# EAGLE design Strvo_Tester_STM_v4 (EAGLE 6.5.0)
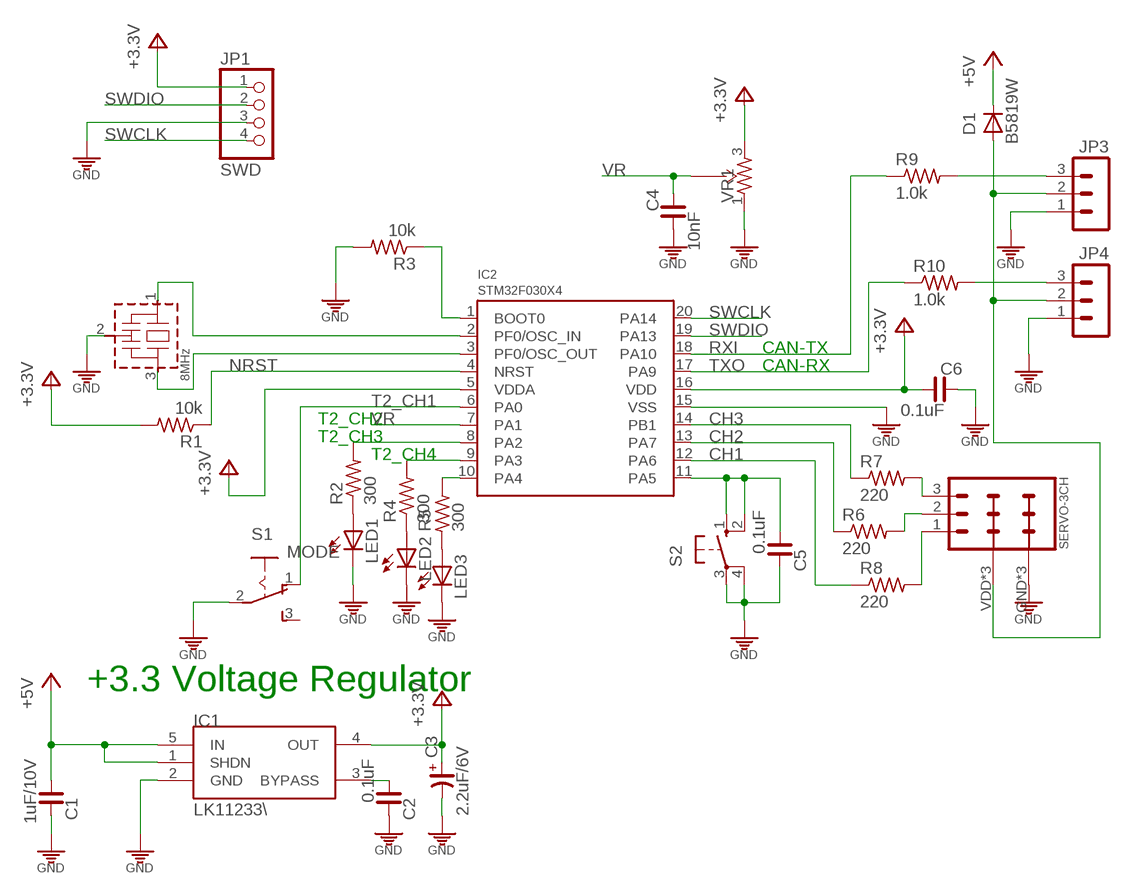
[diagram p0: schematic, sheet 1]

## Parts
C1  1uF/10V  C_0603  [C0603]
C2  0.1uF  C_0603  [C0603]
C3  2.2uF/6V  CP_2012  [C2012/T]
C4  10nF  C_0603  [C0603]
C5  0.1uF  C_0603  [C0603]
C6  0.1uF  C_0603  [C0603]
D1  B5819W  B5189WN  [SOD323]
IC1  LK11233\  LK112XX  [SOT23-5L]
IC2  STM32F030X4  [TSSOP20]
JP1  SWD  PINHD-1X4M  [1X04M]
JP2  SERVO-3CH  [SERVO-3CH1]
JP3  MA03-1SMALL  [MA03-1-S]
JP4  MA03-1SMALL  [MA03-1-S]
LED1  LED3MM  [LED3MM]
LED2  LED3MM  [LED3MM]
LED3  LED3MM  [LED3MM]
Q1  8MHz  X-TAL-SMALLCSTCE16M00V53  [CSTLA_X]
R1  10k  R-US_R1608  [R0603]
R2  300  R-US_R1608  [R0603]
R3  10k  R-US_R1608  [R0603]
R4  300  R-US_R1608  [R0603]
R5  300  R_0603  [R0603]
R6  220  R-US_R1608  [R0603]
R7  220  R-US_R1608  [R0603]
R8  220  R-US_R1608  [R0603]
R9  1.0k  R-US_R1608  [R0603]
R10  1.0k  R-US_R1608  [R0603]
S1  MODE  IMMS  [255SB]
S2  10-XX  [B3F-10XX]
VR1  R-TRIMMER-SMDPTV  [PTV09]

## Nets
3V3: C3.+ C6.2 IC1.4(OUT) IC2.5(VDDA) IC2.16(VDD) JP1.1 R1.2 VR1.3 ; supply symbol labelled +3V3
+5V: C1.2 D1.C IC1.1(SHDN) IC1.5(IN)
CH1: IC2.12(PA6) R8.1
CH2: IC2.13(PA7) R6.1
CH3: IC2.14(PB1) R7.1
GND: C1.1 C2.1 C3.- C4.2 C5.1 C6.1 IC1.2(GND) IC2.15(VSS) JP1.3 JP2.GND JP2.GND@1(GND) JP2.GND@2(GND) JP3.1 JP4.1 LED1.K(C) LED2.K(C) LED3.K(C) Q1.2(GND) R3.2 S1.2(P) S2.3(P) S2.4(P1) VR1.1
N$1: LED1.A R2.1
N$2: IC2.2(PF0/OSC_IN) Q1.1(IN)
N$3: IC2.3(PF0/OSC_OUT) Q1.3(OUT)
N$4: JP2.3 R7.2
N$5: IC2.8(PA2) R2.2
N$6: IC2.1(BOOT0) R3.1
N$7: C5.2 IC2.11(PA5) S2.1(S) S2.2(S1)
N$8: C2.2 IC1.3(BYPASS)
N$9: JP2.2 R6.2
N$10: IC2.10(PA4) R5.2
N$11: LED2.A R4.1
N$12: JP2.1 R8.2
N$13: IC2.9(PA3) R4.2
N$14: JP3.3 R9.2
N$15: JP4.3 R10.2
N$17: LED3.A R5.1
N$18: D1.A JP2.VDD(+5V) JP2.VDD@1(+5V) JP2.VDD@2(+5V) JP3.2 JP4.2
NRST: IC2.4(NRST) R1.1
RXI: IC2.18(PA10) R9.1
SWCLK: IC2.20(PA14) JP1.4
SWDIO: IC2.19(PA13) JP1.2
T2_CH1: IC2.6(PA0) S1.1(O)
TXO: IC2.17(PA9) R10.1
VR: C4.1 IC2.7(PA1) VR1.2
Unconnected: S1.3(S)

## Notes on the sheet
- CAN-TX
- CAN-RX
- T2_CH2
- T2_CH3
- T2_CH4
- +3.3 Voltage Regulator

## Library data of the parts
C1 C2 C4-C6 = cona_lib:C_: NON-POLARIZED CAP
C3 = rc-master-smd:CP_: POLARIZED CAP
D1 = cona_lib:B5189W
IC1 = cona_lib:LK112XX: ST
IC2 = stm32:STM32F030X4
JP1 = pinhead:PINHD-1X4: PIN HEADER
JP2 = cona_lib:SERVO-3CH
JP3 JP4 = cona_lib:MA03-1: PIN HEADER
LED1-LED3 = cona_lib:LED: LED OSRAM: - CHIPLED LG R971, LG N971, LY N971, LG Q971, LY Q971, LO R971, LY R971 LH N974, LH R974 LS Q976, LO Q976, LY Q976 LO Q996 - Hyper CHIPLED LW Q18S LB Q993, LB Q99A, LB R99A - SideLED LS A670, LO A670, LY A670, LG A670, LP A670 LB A673, LV A673, LT A673, LW A673 LH A674 LY A675 LS A676, LA A676, LO A676, LY A676, LW A676 LS A679, LY A679, LG A679 - Hyper Micro SIDELED® LS Y876, LA Y876, LO Y876, LY Y876 LT Y87S - SmartLED LW L88C, LW L88S LB L89C, LB L89S, LG L890 LS L89K, LO L89K, LY L89K LS L896, LA L896, LO L896, LY L896 - TOPLED LS T670, LO T670, LY T670, LG T670, LP T670 LSG T670, LSP T670, LSY T670, LOP T670, LYG T670 LG T671, LOG T671, LSG T671 LB T673, LV T673, LT T673, LW T673 LH T674 LS T676, LA T676, LO T676, LY T676, LB T676, LH T676, LSB T676, LW T676 LB T67C, LV T67C, LT T67C, LS T67K, LO T67K, LY T67K, LW E67C LS E67B, LA E67B, LO E67B, LY E67B, LB E67C, LV E67C, LT E67C LW T67C LS T679, LY T679, LG T679 LS T770, LO T770, LY T770, LG T770, LP T770 LB T773, LV T773, LT T773, LW T773 LH T774 LS E675, LA E675, LY E675, LS T675 LS T776, LA T776, LO T776, LY T776, LB T776 LHGB T686 LT T68C, LB T68C - Hyper Mini TOPLED® LB M676 - Mini TOPLED Santana® LG M470 LS M47K, LO M47K, LY M47K Source: http://www.osram.convergy.de LUXEON: - LUMILED® LXK2-PW12-R00, LXK2-PW12-S00, LXK2-PW14-U00, LXK2-PW14-V00 LXK2-PM12-R00, LXK2-PM12-S00, LXK2-PM14-U00 LXK2-PE12-Q00, LXK2-PE12-R00, LXK2-PE12-S00, LXK2-PE14-T00, LXK2-PE14-U00 LXK2-PB12-K00, LXK2-PB12-L00, LXK2-PB12-M00, LXK2-PB14-N00, LXK2-PB14-P00, LXK2-PB14-Q00 LXK2-PR12-L00, LXK2-PR12-M00, LXK2-PR14-Q00, LXK2-PR14-R00 LXK2-PD12-Q00, LXK2-PD12-R00, LXK2-PD12-S00 LXK2-PH12-R00, LXK2-PH12-S00 LXK2-PL12-P00, LXK2-PL12-Q00, LXK2-PL12-R00 Source: www.luxeon.com KINGBRIGHT: KA-3528ASYC Source: www.kingbright.com
Q1 = cona_lib:X-TAL-SMALL: Ceramic Resonators MuRata CSTCE08MOOG52A
R1-R4 R6-R10 = cona_lib:R-US_: RESISTOR, American symbol
R5 = cona_lib:R_: RESISTOR
S1 = cona_lib:IMMS: SLIDING SWITCH Distributor Buerklin, 11G810
S2 = switch-omron:10-XX: OMRON SWITCH; MPN: B3F-1000; OC_FARNELL: 176432; OC_NEWARK: 36M3542
VR1 = cona_lib:R-TRIMMER-SMD: SMD R-TRIMMER

## Net classes
0 default: width 0.178 mm, drill 0.3 mm, clearance 0.178 mm
2 GND: width 0.406 mm, clearance 0.152 mm

## Board
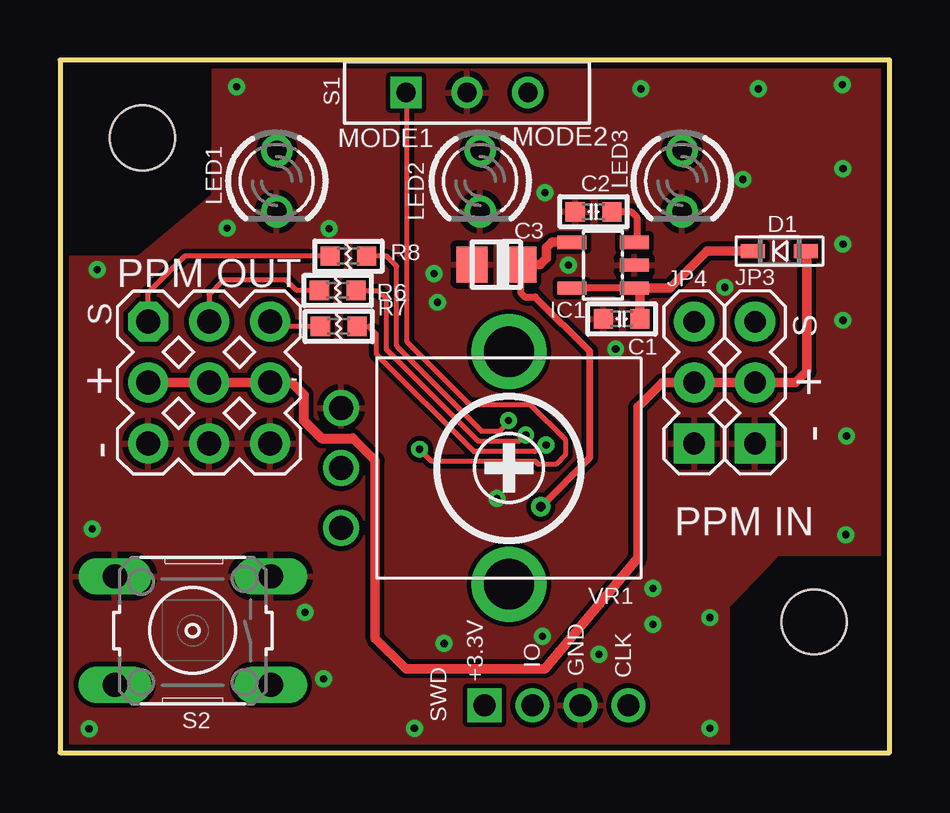
[diagram p1: board, top side]
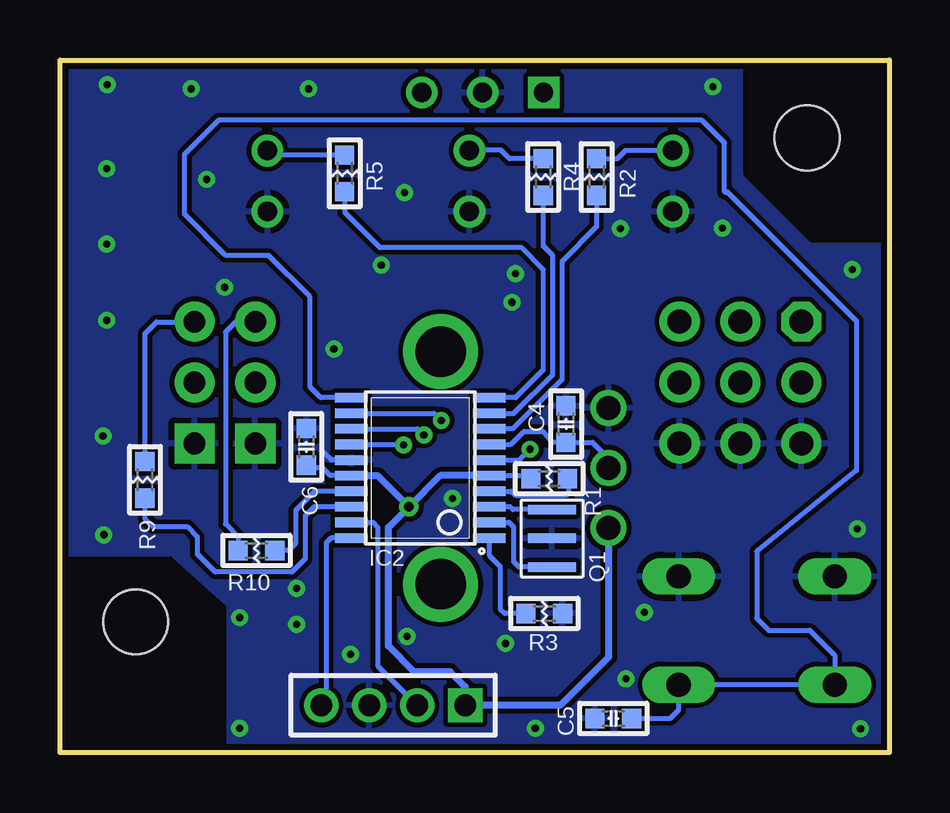
[diagram p2: board, bottom side, seen from below]

Size 34.58 x 28.88 mm. Coordinates in mm from the lower left corner, seen from the top.
Outline: 34.58,0 34.58,28.88 0,28.88 0,0 34.58,0
Copper layers (1+16): Top 0.035mm / dielectric 1.5mm / Bottom 0.035mm
Design rules "default": minimum track width 0.2mm, minimum drill 0.3mm, track to track 0.2mm, track to pad 0.2mm, pad to pad 0.2mm, via to via 0.2mm, smd to smd 0.2mm, copper to edge 10mil, drill to drill 0.2mm, minimum pad ring 10mil, minimum via ring 8mil, stop-mask expansion 4mil, vias tented up to drill 0mil, thermal gap 10mil
Holes 2.7 mm at 31.43,5.45 3.43,25.63

### Footprints (pad centres in the part's own frame; a part is rotated, then mirrored left to right if it is on the bottom)
C0603 = smd 0.8 x 0.8: 1 -0.762,0; 2 0.762,0
C2012/T = smd 1.3 x 1.5: + 1.016,0; - -1.016,0
SOD323 = smd 1 x 0.6: A 1.1,0; C -1.1,0
SOT23-5L = smd 0.55 x 1.2: 1 -0.95,-1.3; 2 0,-1.3; 3 0.95,-1.3; 4 0.95,1.3; 5 -0.95,1.3
TSSOP20 = smd 0.4 x 1.35: 1 -2.925,-2.875; 2 -2.275,-2.875; 3 -1.625,-2.875; 4 -0.975,-2.875; 5 -0.325,-2.875; 6 0.325,-2.875; 7 0.975,-2.875; 8 1.625,-2.875; 9 2.275,-2.875; 10 2.925,-2.875; 11 2.925,2.875; 12 2.275,2.875; 13 1.625,2.875; 14 0.975,2.875; 15 0.325,2.875; 16 -0.325,2.875; 17 -0.975,2.875; 18 -1.625,2.875; 19 -2.275,2.875; 20 -2.925,2.875
1X04M = drill 0.914 square: 1 -3,0 | drill 0.914: 2 -1,0; 3 1,0; 4 3,0
SERVO-3CH1 = drill 1 pad 1.676 octagon: 1 -2.54,2.54 | drill 1 pad 1.676: 2 0,2.54; 3 2.54,2.54; GND -2.54,-2.54; GND@1 0,-2.54; GND@2 2.54,-2.54; VDD -2.54,0; VDD@1 0,0; VDD@2 2.54,0
MA03-1-S = drill 0.9 pad 1.676 square: 1 -2.54,0 | drill 0.9 pad 1.676: 2 0,0; 3 2.54,0
LED3MM = drill 0.813: A -1.27,0; K 1.27,0
CSTLA_X = smd 0.4 x 2: 1 -1.19,-0.02; 2 0.01,-0.02; 3 1.21,-0.02
R0603 = smd 0.8 x 0.8: 1 -0.762,0; 2 0.762,0
255SB = drill 0.8 square: 1 -2.54,0 | drill 0.8: 2 0,0; 3 2.54,0
B3F-10XX = drill 1.016 long: 1 -3.251,2.261; 2 3.251,2.261; 3 -3.251,-2.261; 4 3.251,-2.261
PTV09 = drill 1: 1 -2.5,-7; 2 0,-7; 3 2.5,-7 | drill 2.1 pad 2.54: P$1 -4.85,0; P$2 4.85,0

### Placement (x,y rotation side)
C1  23.41,18.09 0 top
C2  22.23,22.55 0 top
C3  18.18,20.35 0 top
C4  13.49,13.7 90 bottom
C5  11.51,1.43 0 bottom
C6  24.31,12.75 270 bottom
D1  29.98,20.91 0 top
IC1  22.64,20.32 90 top
IC2  19.56,11.88 90 bottom
JP1  20.68,1.98 180 bottom
JP2  6.21,15.43 0 top
JP3  28.97,15.43 90 top
JP4  26.43,15.43 90 top
LED1  9.03,23.83 270 top
LED2  17.51,23.83 270 top
LED3  25.93,23.83 270 top
Q1  14.09,8.92 90 bottom
R1  14.19,11.42 180 bottom
R2  12.21,24 270 bottom
R3  14.38,5.8 0 bottom
R4  14.44,24 270 bottom
R5  22.71,24.15 270 bottom
R6  11.57,19.27 180 top
R7  11.61,17.77 180 top
R8  12.02,20.7 180 top
R9  31.04,11.38 90 bottom
R10  26.39,8.43 180 bottom
S1  16.96,27.52 0 top
S2  5.53,5.09 180 top
VR1  18.71,11.87 270 top

### Tracks (layer width: path | path; a pad name or v marks a point on that pad's centre or on a via)
3V3  (via drill 0.4)
  Top 0.3: v20.04,10.25 22.09,12.3 22.09,16.73 19.8,19 19.38,19 19.2,19.18 C3.+
  Top 0.4: C3.+ 20,20.35 20.28,20.63 20.28,21.05 20.5,21.28 IC1.4
  Bottom 0.2: IC2.5 14.97,11.55 R1.2 | IC2.16 23.31,11.55 23.64,11.88 24.1,11.88 C6.2
  Bottom 0.3: VR1.3 11.71,3.98 13.71,1.98 JP1.1 17.68,2.75 18.31,3.38 19.81,3.38 20.89,4.45 20.89,9.4 v20.04,10.25 | IC2.5 18.73,11.55 v20.04,10.25 | IC2.16 21.34,11.55 v20.04,10.25
+5V
  Top 0.3: 21.14,19.4 IC1.5 IC1.1
  Top 0.4: C1.2 24.17,19.14 IC1.1 25.43,19.38 26.96,20.91 D1.C
CH1  (via drill 0.3)
  Top 0.2: v18.68,13.85 18.68,13.8 18.29,13.4 17.59,13.4 14.03,16.95 14.03,20.28 13.61,20.7 R8.1
  Bottom 0.2: IC2.12 18.98,14.15 v18.68,13.85
CH2  (via drill 0.3)
  Top 0.2: v19.41,13.25 19.14,12.97 17.43,12.97 13.61,16.8 13.61,18.91 13.26,19.25 12.35,19.25 R6.1
  Bottom 0.2: IC2.13 19.66,13.5 v19.41,13.25
CH3  (via drill 0.3)
  Top 0.2: v20.26,12.82 20.26,12.85 20.09,12.85 19.79,12.55 17.26,12.55 13.18,16.63 13.18,17.45 12.86,17.77 R7.1
  Bottom 0.2: IC2.14 20.26,12.85 v20.26,12.82
GND  (via drill 0.3)
  Bottom 0.2: IC2.15 23.26,12.2 23.56,12.5
  other vias: 10.99,3.07 15.59,19.98 11.21,21.85 18.21,10.6 24.71,5.35 24.71,6.85 10.21,5.85 6.96,21.88 7.36,27.76 1.34,9.33 20.21,23.35 28.46,23.9 27.71,19.4 32.61,27.85 32.63,24.35 32.63,21.2 32.63,18.02 32.78,13.2 24.21,27.68 1.21,1 29.11,27.68 21.18,20.32 23.16,16.82 15.74,18.77 22.46,4.1 16.01,4.55 20.11,4.85 1.54,20.14 14.77,1.01 27.09,1.01 32.75,9.08 27.09,5.63
  pour Top (rank 3): 0,0 0,28.88 34.58,28.88 34.58,0
  pour Bottom (rank 2): 0,0 0,28.88 34.58,28.88 34.58,0
N$1
  Bottom 0.2: LED1.A 11.01,25.1 11.36,24.75 R2.1
N$2
  Bottom 0.2: IC2.2 15.86,9.6 15.66,9.4 15.66,7.95 15.45,7.73 Q1.1
N$3
  Bottom 0.2: Q1.3 15.7,10.13 15.81,10.25 IC2.3
N$4
  Top 0.2: R7.2 8.95,17.77 JP2.3
N$5
  Bottom 0.2: IC2.8 15.71,13.5 13.63,15.57 13.63,20.5 12.21,21.93 R2.2
N$6
  Bottom 0.2: IC2.1 16.68,8.23 16.23,7.77 16.23,6 16.04,5.8 R3.1
N$7
  Bottom 0.2: IC2.11 23.71,14.8 24.16,15.25 24.16,19.01 25.88,20.73 27.66,20.73 29.39,22.45 29.39,24.95 27.96,26.38 7.83,26.38 6.88,25.43 6.88,23.38 6.76,23.38 1.38,18 1.38,11.77 5.53,8.38 5.53,5.61 5.03,5.11 3.33,5.11 2.28,4.06 S2.2 S2.1 8.78,1.78 9.13,1.43 C5.2
N$8
  Top 0.3: C2.2 23.81,22.55 24.04,22.32 24.04,21.4 IC1.3
N$9
  Top 0.2: R6.2 9.86,19.27 9.43,19.7 6.8,19.7 6.21,19.11 JP2.2
N$10
  Bottom 0.2: IC2.10 15.59,14.8 14.44,15.95 14.44,20.16 15.33,21.05 21.23,21.05 22.71,22.54 R5.2
N$11
  Bottom 0.2: R4.1 15.84,24.76 16.2,25.13 17.48,25.13 LED2.A
N$12
  Top 0.2: R8.2 5.2,20.7 3.66,19.16 3.66,17.98 JP2.1
N$13
  Bottom 0.2: IC2.9 16.66,14.12 15.69,14.12 14.04,15.78 14.04,20.71 14.43,21.11 R4.2
N$14
  Bottom 0.2: R9.2 31.04,17.48 30.55,17.95 28.98,17.95 JP3.3
N$15
  Bottom 0.2: R10.2 27.16,9 27.68,9.53 27.68,17.53 27.23,17.98 26.45,17.98 JP4.3
N$16
  cutout Bottom: 0,21.35 3.21,21.35 5.98,24.12 5.98,28.88 0,28.88
  cutout Top: 0,20.85 3.21,20.85 6.21,23.35 6.21,28.88 0,28.88
N$17
  Bottom 0.2: R5.1 25.67,24.91 LED3.A
N$18
  Top 0.4: JP2.VDD@2 JP2.VDD@1 JP2.VDD | 12.21,13.1 13.13,12.17 13.13,4.77 14.41,3.5 20.21,3.5 24.09,8.12 24.09,12.51 24.08,12.52 24.08,14.4 25.11,15.43 JP4.2 JP3.2 30.66,15.43 31.13,15.9 31.13,20.86 D1.A
  Top 0.406: JP2.VDD@2 9.65,15.43 10.15,14.93 10.15,13.86 10.91,13.11 12.21,13.11 12.21,13.1
N$19
  cutout Bottom: 34.58,8.08 29.98,8.08 27.75,6.08 27.75,0 34.58,0
  cutout Top: 34.58,8.08 29.98,8.08 28.02,6.04 28.02,0 34.58,0
NRST
  Bottom 0.2: IC2.4 15.76,10.9 15.59,10.72 13.49,10.72 13.36,10.85 13.36,11.39 R1.1
RXI
  Bottom 0.2: R9.1 31.03,9.75 30.71,9.43 29.28,9.43 28.86,9 28.86,8.28 28.11,7.53 24.91,7.53 24.36,8.08 24.36,9.88 23.98,10.25 IC2.18
SWCLK
  Bottom 0.2: IC2.20 23.29,8.95 23.48,8.75 23.48,2.18 JP1.4
SWDIO
  Bottom 0.2: JP1.2 21.34,3.62 21.34,9.4 21.54,9.6 IC2.19
T2_CH1  (via drill 0.3)
  Top 0.2: v14.99,12.65 15.49,12.15 19.81,12.15 19.93,12.03 20.66,12.03 21.06,12.42 21.06,13.05 19.59,14.53 17.06,14.53 14.46,17.13 14.46,27.49 S1.1
  Bottom 0.2: IC2.6 15.44,12.2 v14.99,12.65
TXO
  Bottom 0.2: IC2.17 23.96,10.9 24.75,10.11 24.75,8.73 25.05,8.43 R10.1
VR
  Bottom 0.2: IC2.7 15.79,12.85 15.24,13.4 14.44,13.4 14.09,12.95 13.22,12.95 C4.1 12.37,12.94 11.81,12.38 11.81,11.95 VR1.2

### Text on the board
_tsilk: MODE1 | MODE2 | PPM OUT | S | S | - | + | + | - | - | PPM IN | +3.3V | IO | GND | CLK | SWD